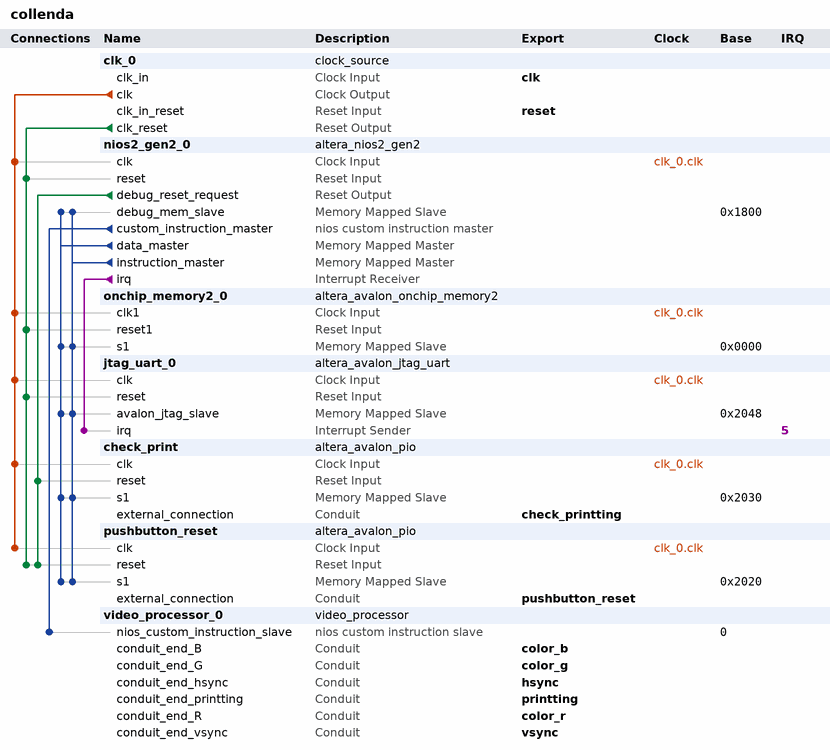
[diagram p0: system contents]
# Platform Designer (Qsys) system collenda, Cyclone IV E EP4CE22F17C6
# Parameters at their usual value, and those the tool derives, are not listed.
package require -exact qsys 18.1
create_system collenda
set_project_property DEVICE_FAMILY {Cyclone IV E}
set_project_property DEVICE EP4CE22F17C6

add_instance clk_0 clock_source 18.1
set_instance_parameter_value clk_0 clockFrequency 50000000

add_instance nios2_gen2_0 altera_nios2_gen2 18.1
set_instance_parameter_value nios2_gen2_0 dcache_size 2048
set_instance_parameter_value nios2_gen2_0 exceptionSlave onchip_memory2_0.s1
set_instance_parameter_value nios2_gen2_0 icache_size 4096
set_instance_parameter_value nios2_gen2_0 impl Tiny
set_instance_parameter_value nios2_gen2_0 resetSlave onchip_memory2_0.s1

add_instance onchip_memory2_0 altera_avalon_onchip_memory2 18.1
set_instance_parameter_value onchip_memory2_0 dataWidth 32
set_instance_parameter_value onchip_memory2_0 dualPort false
set_instance_parameter_value onchip_memory2_0 initMemContent true
set_instance_parameter_value onchip_memory2_0 initializationFileName onchip_mem.hex
set_instance_parameter_value onchip_memory2_0 memorySize 4096
set_instance_parameter_value onchip_memory2_0 useNonDefaultInitFile true

add_instance jtag_uart_0 altera_avalon_jtag_uart 18.1
set_instance_parameter_value jtag_uart_0 simInteractiveOptions NO_INTERACTIVE_WINDOWS

add_instance check_print altera_avalon_pio 18.1
set_instance_parameter_value check_print direction Input
set_instance_parameter_value check_print width 1

add_instance pushbutton_reset altera_avalon_pio 18.1
set_instance_parameter_value pushbutton_reset direction Input
set_instance_parameter_value pushbutton_reset width 1

add_instance video_processor_0 video_processor 1.0

# connections
add_connection clk_0.clk check_print.clk clock
add_connection clk_0.clk jtag_uart_0.clk clock
add_connection clk_0.clk nios2_gen2_0.clk clock
add_connection clk_0.clk onchip_memory2_0.clk1 clock
add_connection clk_0.clk pushbutton_reset.clk clock
add_connection clk_0.clk_reset jtag_uart_0.reset reset
add_connection clk_0.clk_reset nios2_gen2_0.reset reset
add_connection clk_0.clk_reset onchip_memory2_0.reset1 reset
add_connection clk_0.clk_reset pushbutton_reset.reset reset
add_connection nios2_gen2_0.debug_reset_request check_print.reset reset
add_connection nios2_gen2_0.debug_reset_request pushbutton_reset.reset reset
add_connection nios2_gen2_0.data_master check_print.s1 avalon
set_connection_parameter_value nios2_gen2_0.data_master/check_print.s1 baseAddress 0x2030
add_connection nios2_gen2_0.data_master jtag_uart_0.avalon_jtag_slave avalon
set_connection_parameter_value nios2_gen2_0.data_master/jtag_uart_0.avalon_jtag_slave baseAddress 0x2048
add_connection nios2_gen2_0.data_master nios2_gen2_0.debug_mem_slave avalon
set_connection_parameter_value nios2_gen2_0.data_master/nios2_gen2_0.debug_mem_slave baseAddress 0x1800
add_connection nios2_gen2_0.data_master onchip_memory2_0.s1 avalon
set_connection_parameter_value nios2_gen2_0.data_master/onchip_memory2_0.s1 baseAddress 0x0000
add_connection nios2_gen2_0.data_master pushbutton_reset.s1 avalon
set_connection_parameter_value nios2_gen2_0.data_master/pushbutton_reset.s1 baseAddress 0x2020
add_connection nios2_gen2_0.instruction_master check_print.s1 avalon
set_connection_parameter_value nios2_gen2_0.instruction_master/check_print.s1 baseAddress 0x2030
add_connection nios2_gen2_0.instruction_master jtag_uart_0.avalon_jtag_slave avalon
set_connection_parameter_value nios2_gen2_0.instruction_master/jtag_uart_0.avalon_jtag_slave baseAddress 0x2048
add_connection nios2_gen2_0.instruction_master nios2_gen2_0.debug_mem_slave avalon
set_connection_parameter_value nios2_gen2_0.instruction_master/nios2_gen2_0.debug_mem_slave baseAddress 0x1800
add_connection nios2_gen2_0.instruction_master onchip_memory2_0.s1 avalon
set_connection_parameter_value nios2_gen2_0.instruction_master/onchip_memory2_0.s1 baseAddress 0x0000
add_connection nios2_gen2_0.instruction_master pushbutton_reset.s1 avalon
set_connection_parameter_value nios2_gen2_0.instruction_master/pushbutton_reset.s1 baseAddress 0x2020
add_connection nios2_gen2_0.irq jtag_uart_0.irq interrupt
set_connection_parameter_value nios2_gen2_0.irq/jtag_uart_0.irq irqNumber 5
add_connection nios2_gen2_0.custom_instruction_master video_processor_0.nios_custom_instruction_slave nios_custom_instruction
set_connection_parameter_value nios2_gen2_0.custom_instruction_master/video_processor_0.nios_custom_instruction_slave CIName video_processor_0
set_connection_parameter_value nios2_gen2_0.custom_instruction_master/video_processor_0.nios_custom_instruction_slave baseAddress 0

# exported interfaces
add_interface check_printting conduit end
set_interface_property check_printting EXPORT_OF check_print.external_connection
add_interface clk clock sink
set_interface_property clk EXPORT_OF clk_0.clk_in
add_interface color_b conduit end
set_interface_property color_b EXPORT_OF video_processor_0.conduit_end_B
add_interface color_g conduit end
set_interface_property color_g EXPORT_OF video_processor_0.conduit_end_G
add_interface color_r conduit end
set_interface_property color_r EXPORT_OF video_processor_0.conduit_end_R
add_interface hsync conduit end
set_interface_property hsync EXPORT_OF video_processor_0.conduit_end_hsync
add_interface printting conduit end
set_interface_property printting EXPORT_OF video_processor_0.conduit_end_printting
add_interface pushbutton_reset conduit end
set_interface_property pushbutton_reset EXPORT_OF pushbutton_reset.external_connection
add_interface reset reset sink
set_interface_property reset EXPORT_OF clk_0.clk_in_reset
add_interface vsync conduit end
set_interface_property vsync EXPORT_OF video_processor_0.conduit_end_vsync

set_interconnect_requirement {$system} qsys_mm.clockCrossingAdapter HANDSHAKE
set_interconnect_requirement {$system} qsys_mm.enableEccProtection FALSE
set_interconnect_requirement {$system} qsys_mm.insertDefaultSlave FALSE
set_interconnect_requirement {$system} qsys_mm.maxAdditionalLatency 1

save_system collenda.qsys
